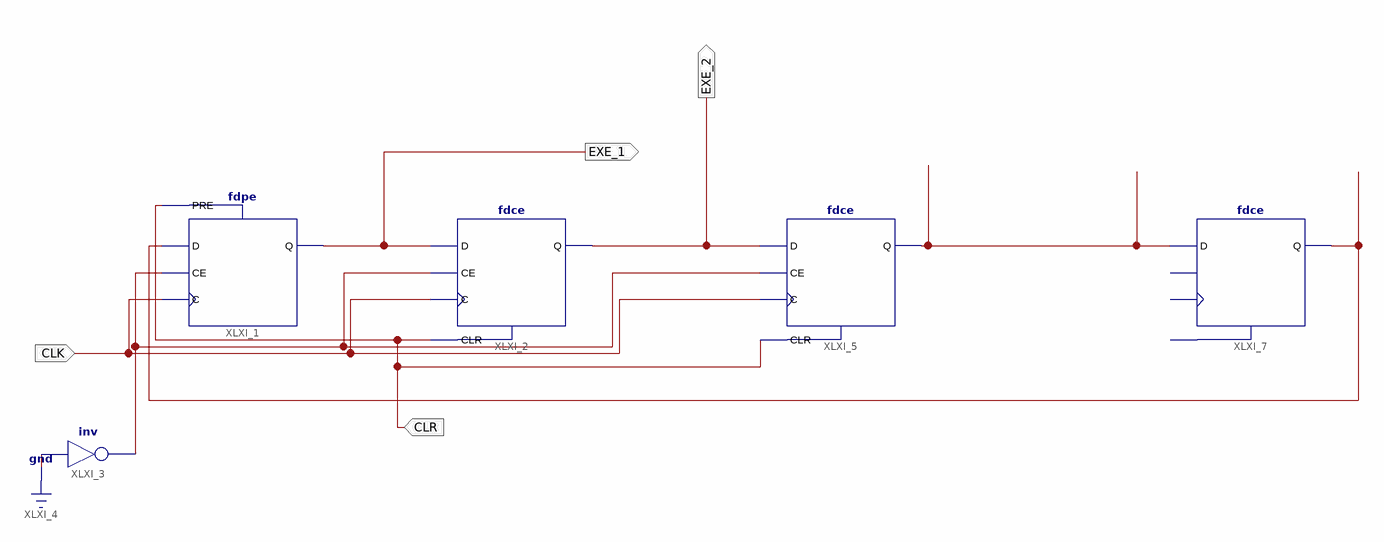
[diagram p0: schematic sheet 1]
// Xilinx ISE schematic sequence_3.sch (spartan3e) as structural Verilog: 5 symbols, 4 ports
module sequence_3 (
  input  CLK,
  input  CLR,
  output EXE_1,
  output EXE_2
);

  wire XLXN_3, XLXN_9, XLXN_11;

  fdpe XLXI_1 (.C(CLK), .CE(XLXN_3), .D(XLXN_11), .PRE(CLR), .Q(EXE_1));
  fdce XLXI_2 (.C(CLK), .CE(XLXN_3), .CLR(CLR), .D(EXE_1), .Q(EXE_2));
  not XLXI_3 (XLXN_3, 1'b0);
  fdce XLXI_5 (.C(CLK), .CE(XLXN_3), .CLR(CLR), .D(EXE_2), .Q(XLXN_9));
  fdce XLXI_7 (.D(XLXN_9), .Q(XLXN_11));  // open: C, CE, CLR
endmodule
